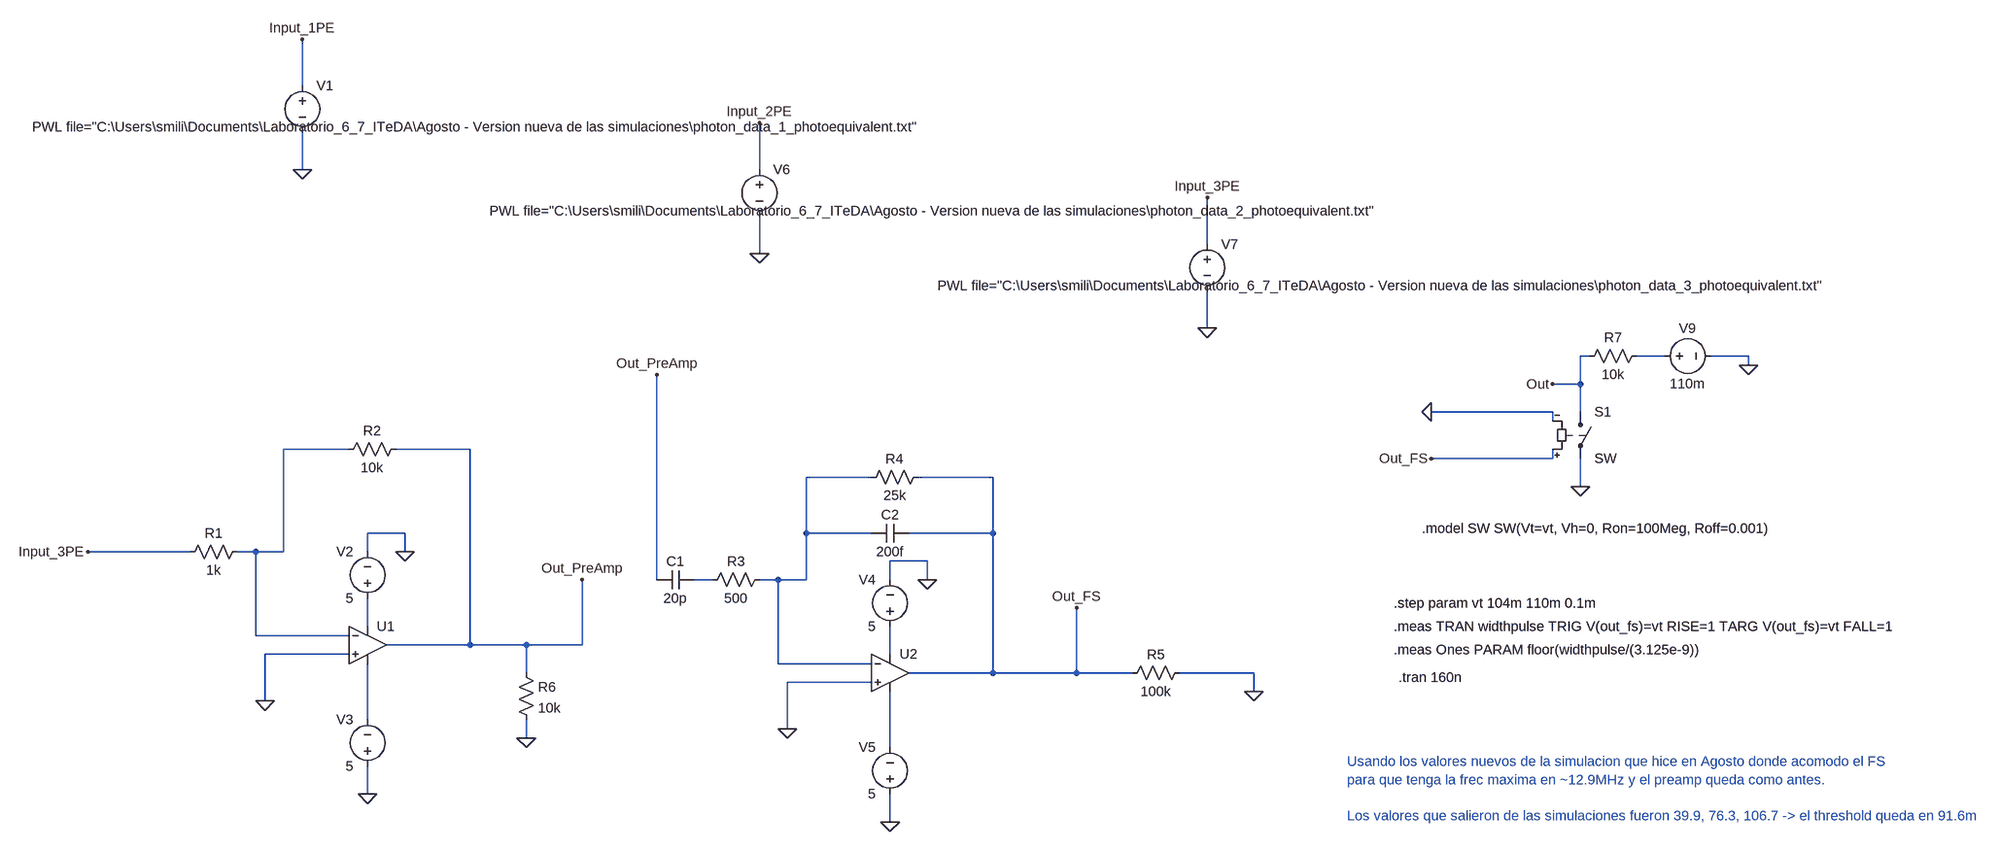
[diagram p0: schematic threshold_calculator.asc]
threshold_calculator.asc, the LTspice schematic file:
Version 4
SHEET 1 2920 852
WIRE -208 -848 -208 -928
WIRE -208 -704 -208 -768
WIRE 576 -704 576 -784
WIRE 1344 -576 1344 -656
WIRE 576 -560 576 -624
WIRE 1344 -432 1344 -496
WIRE 2000 -384 1984 -384
WIRE 2128 -384 2080 -384
WIRE 2272 -384 2208 -384
WIRE 2272 -368 2272 -384
WIRE 1984 -336 1984 -384
WIRE 1984 -336 1936 -336
WIRE 1936 -288 1728 -288
WIRE 1984 -288 1984 -336
WIRE 1936 -272 1936 -288
WIRE -128 -224 -240 -224
WIRE 80 -224 -48 -224
WIRE 1936 -208 1936 -224
WIRE 1936 -208 1728 -208
WIRE 768 -176 656 -176
WIRE 976 -176 848 -176
WIRE 1984 -160 1984 -208
WIRE -32 -80 -96 -80
WIRE 656 -80 656 -176
WIRE 768 -80 656 -80
WIRE 976 -80 976 -176
WIRE 976 -80 832 -80
WIRE -400 -48 -576 -48
WIRE -288 -48 -320 -48
WIRE -240 -48 -240 -224
WIRE -240 -48 -288 -48
WIRE -96 -48 -96 -80
WIRE -32 -48 -32 -80
WIRE 864 -32 800 -32
WIRE 400 0 400 -352
WIRE 496 0 464 0
WIRE 608 0 576 0
WIRE 656 0 656 -80
WIRE 656 0 608 0
WIRE 800 0 800 -32
WIRE 864 0 864 -32
WIRE -96 80 -96 32
WIRE -288 96 -288 -48
WIRE -128 96 -288 96
WIRE 80 112 80 -224
WIRE 80 112 -64 112
WIRE 176 112 80 112
WIRE 272 112 272 0
WIRE 272 112 176 112
WIRE -128 128 -272 128
WIRE 800 128 800 80
WIRE 608 144 608 0
WIRE 768 144 608 144
WIRE 176 160 176 112
WIRE 976 160 976 -80
WIRE 976 160 832 160
WIRE 1120 160 1120 48
WIRE 1120 160 976 160
WIRE 1216 160 1120 160
WIRE 1424 160 1296 160
WIRE 768 176 624 176
WIRE 1424 192 1424 160
WIRE -272 208 -272 128
WIRE -96 240 -96 144
WIRE 624 256 624 176
WIRE 176 272 176 240
WIRE 800 288 800 192
WIRE -96 368 -96 320
WIRE 800 416 800 368
FLAG -96 368 0
FLAG -32 -48 0
FLAG -208 -704 0
FLAG -272 208 0
FLAG 800 416 0
FLAG 864 0 0
FLAG 624 256 0
FLAG 272 0 Out_PreAmp
FLAG 1120 48 Out_FS
FLAG 1424 192 0
FLAG 400 -352 Out_PreAmp
FLAG -208 -928 Input_1PE
FLAG 576 -560 0
FLAG 576 -784 Input_2PE
FLAG -576 -48 Input_3PE
FLAG 176 272 0
FLAG 1344 -432 0
FLAG 1344 -656 Input_3PE
FLAG 1984 -160 0
FLAG 2272 -368 0
FLAG 1936 -336 Out
FLAG 1728 -288 0
FLAG 1728 -208 Out_FS
SYMBOL res -304 -64 R90
WINDOW 0 0 56 VBottom 2
WINDOW 3 32 56 VTop 2
SYMATTR InstName R1
SYMATTR Value 1k
SYMBOL res -32 -240 R90
WINDOW 0 0 56 VBottom 2
WINDOW 3 32 56 VTop 2
SYMATTR InstName R2
SYMATTR Value 10k
SYMBOL voltage -96 48 R180
WINDOW 0 24 96 Left 2
WINDOW 3 24 16 Left 2
WINDOW 123 0 0 Left 0
WINDOW 39 0 0 Left 0
SYMATTR InstName V2
SYMATTR Value 5
SYMBOL voltage -96 336 R180
WINDOW 0 24 96 Left 2
WINDOW 3 24 16 Left 2
WINDOW 123 0 0 Left 0
WINDOW 39 0 0 Left 0
SYMATTR InstName V3
SYMATTR Value 5
SYMBOL OpAmps\\UniversalOpAmp1 -96 112 R0
SYMATTR InstName U1
SYMATTR Value2 Avol=1Meg GBW=100Meg Vos=0
SYMBOL res 592 -16 R90
WINDOW 0 0 56 VBottom 2
WINDOW 3 32 56 VTop 2
SYMATTR InstName R3
SYMATTR Value 500
SYMBOL res 864 -192 R90
WINDOW 0 0 56 VBottom 2
WINDOW 3 32 56 VTop 2
SYMATTR InstName R4
SYMATTR Value 25k
SYMBOL voltage 800 96 R180
WINDOW 0 24 96 Left 2
WINDOW 3 24 16 Left 2
WINDOW 123 0 0 Left 0
WINDOW 39 0 0 Left 0
SYMATTR InstName V4
SYMATTR Value 5
SYMBOL voltage 800 384 R180
WINDOW 0 24 96 Left 2
WINDOW 3 24 16 Left 2
WINDOW 123 0 0 Left 0
WINDOW 39 0 0 Left 0
SYMATTR InstName V5
SYMATTR Value 5
SYMBOL OpAmps\\UniversalOpAmp1 800 160 R0
SYMATTR InstName U2
SYMATTR Value2 Avol=1Meg GBW=800Meg Vos=0
SYMBOL voltage -208 -864 R0
WINDOW 3 -463 87 Left 2
WINDOW 123 0 0 Left 0
WINDOW 39 0 0 Left 0
SYMATTR Value PWL file="C:\Users\smili\Documents\Laboratorio_6_7_ITeDA\Agosto - Version nueva de las simulaciones\photon_data_1_photoequivalent.txt"
SYMATTR InstName V1
SYMBOL res 1312 144 R90
WINDOW 0 0 56 VBottom 2
WINDOW 3 32 56 VTop 2
SYMATTR InstName R5
SYMATTR Value 100k
SYMBOL cap 464 -16 R90
WINDOW 0 0 32 VBottom 2
WINDOW 3 32 32 VTop 2
SYMATTR InstName C1
SYMATTR Value 20p
SYMBOL cap 832 -96 R90
WINDOW 0 0 32 VBottom 2
WINDOW 3 32 32 VTop 2
SYMATTR InstName C2
SYMATTR Value 200f
SYMBOL voltage 576 -720 R0
WINDOW 3 -463 87 Left 2
WINDOW 123 0 0 Left 0
WINDOW 39 0 0 Left 0
SYMATTR Value PWL file="C:\Users\smili\Documents\Laboratorio_6_7_ITeDA\Agosto - Version nueva de las simulaciones\photon_data_2_photoequivalent.txt"
SYMATTR InstName V6
SYMBOL res 160 144 R0
SYMATTR InstName R6
SYMATTR Value 10k
SYMBOL voltage 1344 -592 R0
WINDOW 3 -463 87 Left 2
WINDOW 123 0 0 Left 0
WINDOW 39 0 0 Left 0
SYMATTR Value PWL file="C:\Users\smili\Documents\Laboratorio_6_7_ITeDA\Agosto - Version nueva de las simulaciones\photon_data_3_photoequivalent.txt"
SYMATTR InstName V7
SYMBOL sw 1984 -304 R0
SYMATTR InstName S1
SYMBOL voltage 2112 -384 R270
WINDOW 0 32 56 VTop 2
WINDOW 3 -32 56 VBottom 2
WINDOW 123 0 0 Left 0
WINDOW 39 0 0 Left 0
SYMATTR InstName V9
SYMATTR Value 110m
SYMBOL res 2096 -400 R90
WINDOW 0 0 56 VBottom 2
WINDOW 3 32 56 VTop 2
SYMATTR InstName R7
SYMATTR Value 10k
TEXT 1672 168 Left 2 !.tran 160n
TEXT 1712 -88 Left 2 !.model SW SW(Vt=vt, Vh=0, Ron=100Meg, Roff=0.001)
TEXT 1664 40 Left 2 !.step param vt 104m 110m 0.1m
TEXT 1664 120 Left 2 !.meas Ones PARAM floor(widthpulse/(3.125e-9))
TEXT 1664 80 Left 2 !.meas TRAN widthpulse TRIG V(out_fs)=vt RISE=1 TARG V(out_fs)=vt FALL=1
TEXT 1584 312 Left 2 ;Usando los valores nuevos de la simulacion que hice en Agosto donde acomodo el FS\npara que tenga la frec maxima en ~12.9MHz y el preamp queda como antes.\n \nLos valores que salieron de las simulaciones fueron 39.9, 76.3, 106.7 -> el threshold queda en 91.6m

The netlist it stands for:
* threshold_calculator.asc
R1 N002 Input_3PE 1k
R2 Out_PreAmp N002 10k
V2 N005 0 5
V3 0 N007 5
XU1 0 N002 N005 N007 Out_PreAmp level1 Avol=1Meg GBW=100Meg Vos=0 En=0 Enk=0 In=0 Ink=0 Rin=500Meg  ; pins In+ In- V+ V- OUT
R3 N003 N004 500
R4 Out_FS N003 25k
V4 N006 0 5
V5 0 N008 5
XU2 0 N003 N006 N008 Out_FS level1 Avol=1Meg GBW=800Meg Vos=0 En=0 Enk=0 In=0 Ink=0 Rin=500Meg  ; pins In+ In- V+ V- OUT
V1 Input_1PE 0 PWL file="C:\Users\smili\Documents\Laboratorio_6_7_ITeDA\Agosto - Version nueva de las simulaciones\photon_data_1_photoequivalent.txt"
R5 0 Out_FS 100k
C1 N004 Out_PreAmp 20p
C2 Out_FS N003 200f
V6 Input_2PE 0 PWL file="C:\Users\smili\Documents\Laboratorio_6_7_ITeDA\Agosto - Version nueva de las simulaciones\photon_data_2_photoequivalent.txt"
R6 Out_PreAmp 0 10k
V7 Input_3PE 0 PWL file="C:\Users\smili\Documents\Laboratorio_6_7_ITeDA\Agosto - Version nueva de las simulaciones\photon_data_3_photoequivalent.txt"
S1 Out 0 Out_FS 0 SW
V9 N001 0 110m
R7 N001 Out 10k
.tran 160n
.model SW SW(Vt=vt, Vh=0, Ron=100Meg, Roff=0.001)
.step param vt 104m 110m 0.1m
.meas Ones PARAM floor(widthpulse/(3.125e-9))
.meas TRAN widthpulse TRIG V(out_fs)=vt RISE=1 TARG V(out_fs)=vt FALL=1
* Usando los valores nuevos de la simulacion que hice en Agosto donde acomodo el FS
* para que tenga la frec maxima en ~12.9MHz y el preamp queda como antes.
* Los valores que salieron de las simulaciones fueron 39.9, 76.3, 106.7 -> el threshold queda en 91.6m
.lib UniversalOpAmp1.lib
.backanno
.end